# Altium schematic sheet 2_Airframe-Power_2.SchDoc
size A3; SheetNumber: 2; SheetTotal: 2
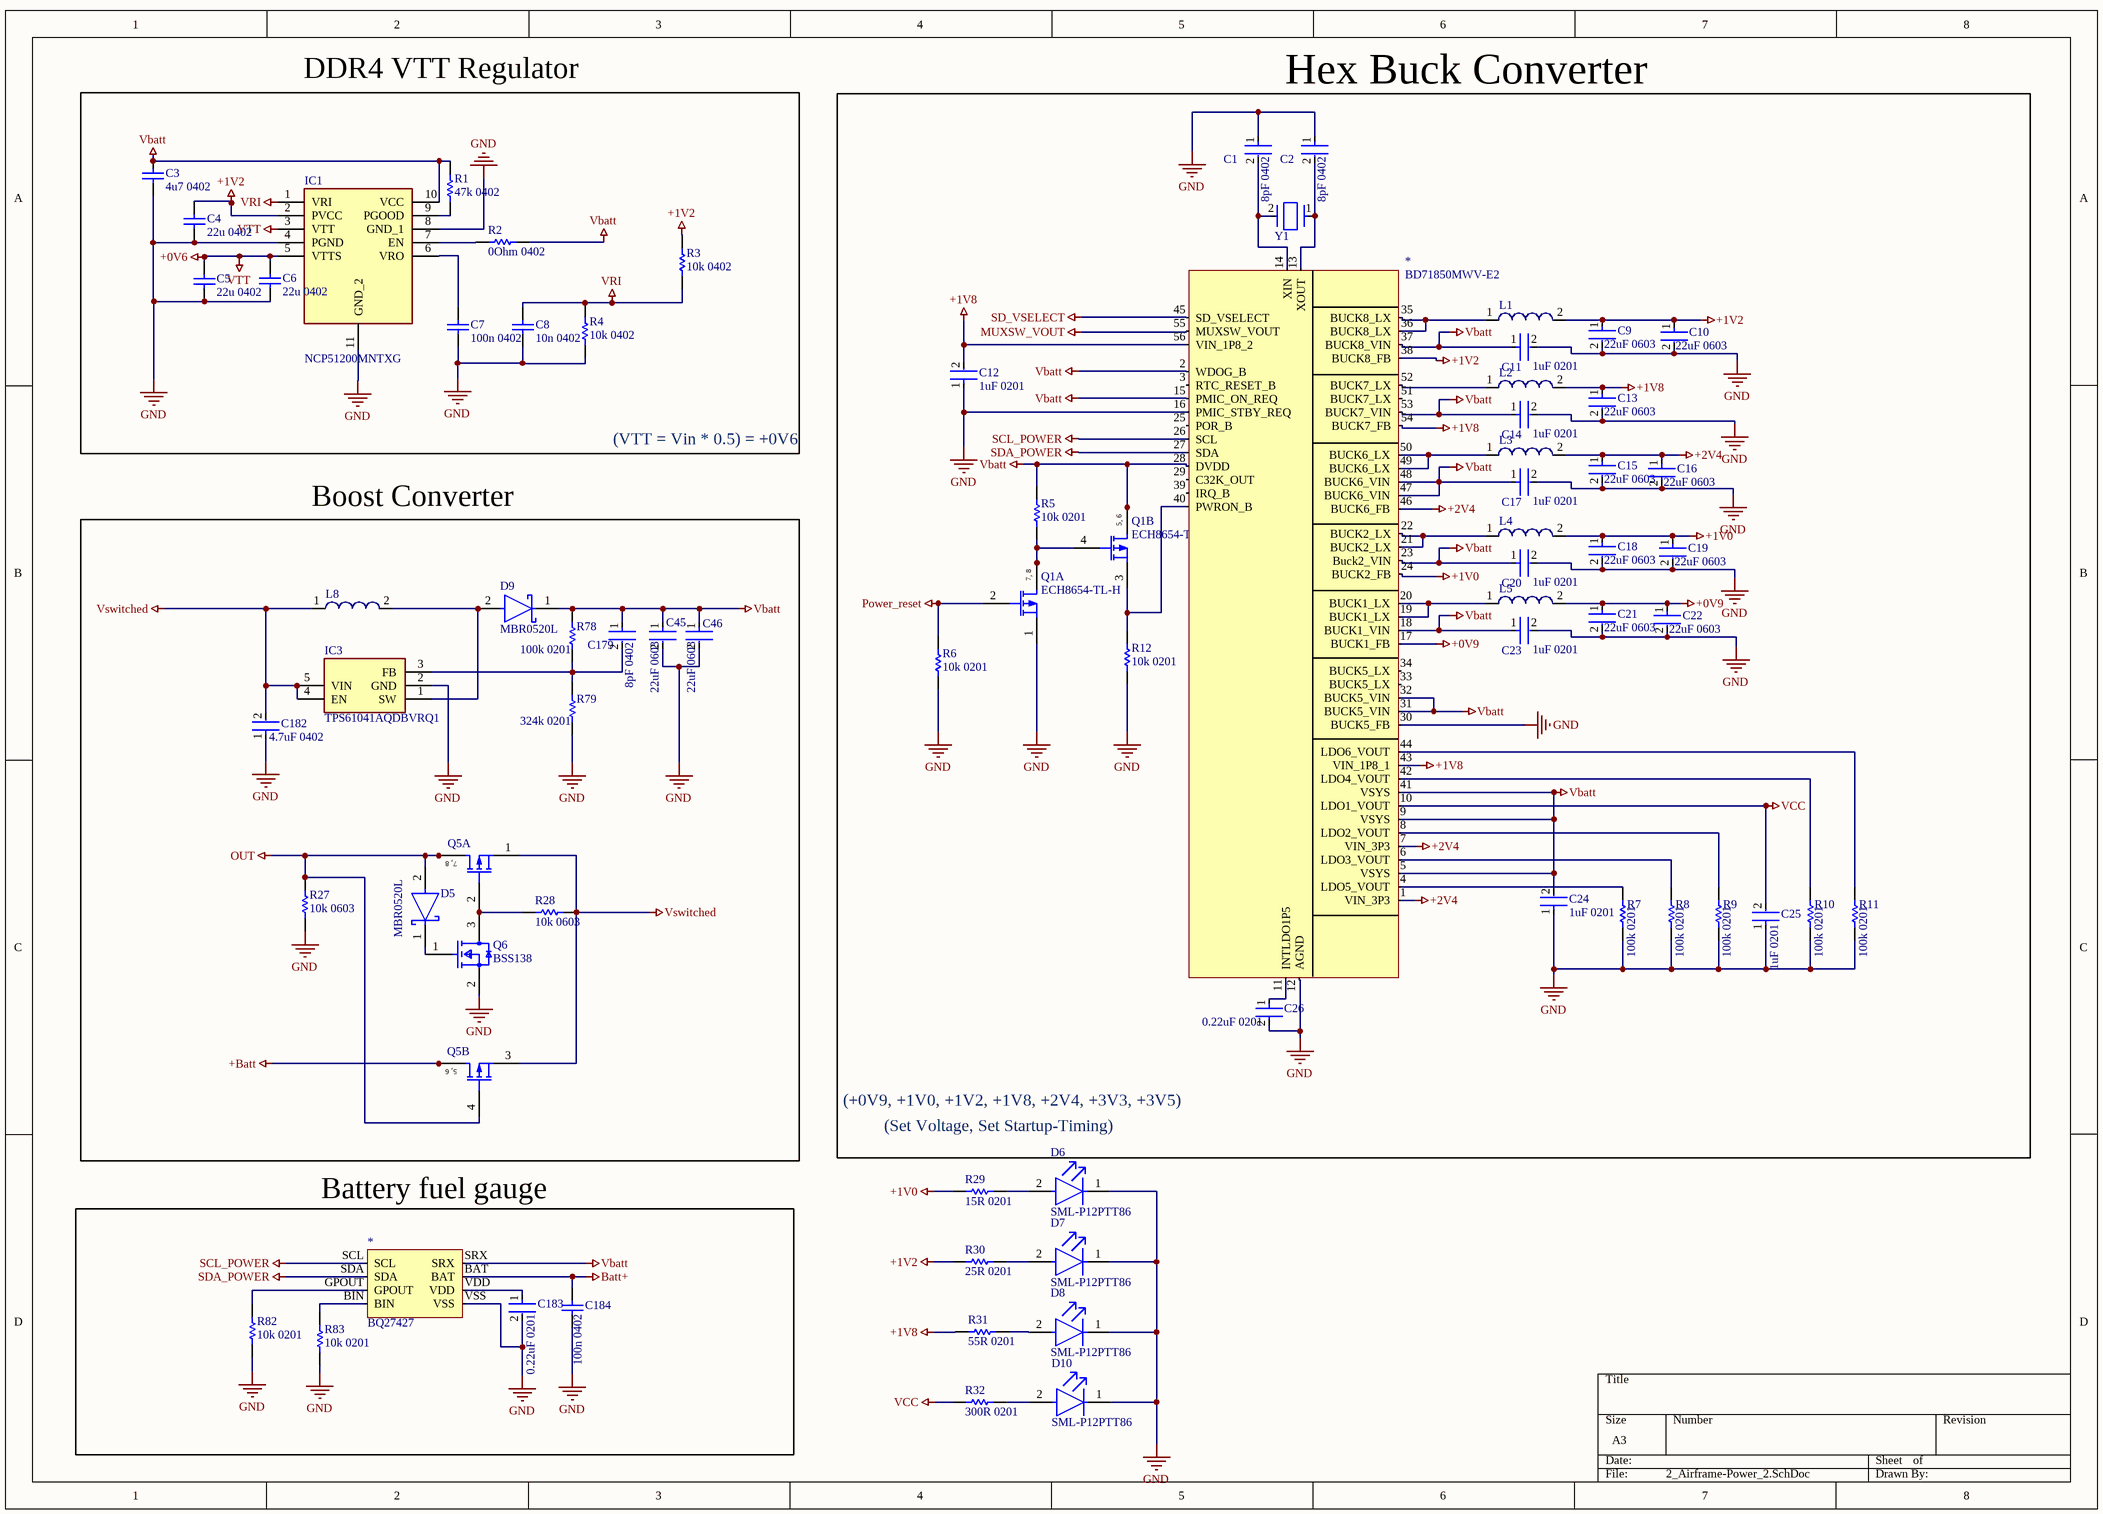
[diagram p0: 2_Airframe-Power_2.SchDoc]

## Parts
(Parts that share a designator on the sheet are numbered #1, #2 ... from top to bottom, then left to right.)
*#1  BD71850MWV-E2  [QFN40P700X700X80_HS-57N]
*#2  BQ27427  [BGA9C50P3X3_158X162X62]
C1  8pF 0402  [FP-C0402C225M9PACTU-MFG]
C2  8pF 0402  [FP-C0402C225M9PACTU-MFG]
C3  4u7 0402  [CAPC1005X55X25ML5T10]
C4  22u 0402  [CAPC1005X55X25ML5T10]
C5  22u 0402  [CAPC1005X55X25ML5T10]
C6  22u 0402  [CAPC1005X55X25ML5T10]
C7  100n 0402  [CAPC1005X55X25ML5T10]
C8  10n 0402  [CAPC1005X55X25ML5T10]
C9  22uF 0603  [FP-GRM188-0_2-IPC_C]
C10  22uF 0603  [FP-GRM188-0_2-IPC_C]
C11  1uF 0201  [FP-C0603-030-0_03-IPC_C]
C12  1uF 0201  [FP-C0603-030-0_03-IPC_C]
C13  22uF 0603  [FP-GRM188-0_2-IPC_C]
C14  1uF 0201  [FP-C0603-030-0_03-IPC_C]
C15  22uF 0603  [FP-GRM188-0_2-IPC_C]
C16  22uF 0603  [FP-GRM188-0_2-IPC_C]
C17  1uF 0201  [FP-C0603-030-0_03-IPC_C]
C18  22uF 0603  [FP-GRM188-0_2-IPC_C]
C19  22uF 0603  [FP-GRM188-0_2-IPC_C]
C20  1uF 0201  [FP-C0603-030-0_03-IPC_C]
C21  22uF 0603  [FP-GRM188-0_2-IPC_C]
C22  22uF 0603  [FP-GRM188-0_2-IPC_C]
C23  1uF 0201  [FP-C0603-030-0_03-IPC_C]
C24  1uF 0201  [FP-C0603-030-0_03-IPC_C]
C25  1uF 0201  [FP-C0603-030-0_03-IPC_C]
C26  0.22uF 0201  [FP-C0603-030-0_03-IPC_C]
C45  22uF 0603  [FP-GRM188-0_2-IPC_C]
C46  22uF 0603  [FP-GRM188-0_2-IPC_C]
C179  8pF 0402  [FP-C0402C225M9PACTU-MFG]
C182  4.7uF 0402  [FP-C0402C225M9PACTU-MFG]
C183  0.22uF 0201  [FP-C0603-030-0_03-IPC_C]
C184  100n 0402  [CAPC1005X55X25ML5T10]
D5  MBR0520L  [FP-MA02A-MFG]
D6  SML-P12PTT86  [FP-SML-P1-MFG]
D7  SML-P12PTT86  [FP-SML-P1-MFG]
D8  SML-P12PTT86  [FP-SML-P1-MFG]
D9  MBR0520L  [FP-MA02A-MFG]
D10  SML-P12PTT86  [FP-SML-P1-MFG]
IC1  NCP51200MNTXG  [SON50P300X300X100-11N]
IC3  TPS61041AQDBVRQ1  [SOT95P280X145-5N]
L1  744040320047  [WE-LQS 3015]  (value not drawn)
L2  744040320047  [WE-LQS 3015]  (value not drawn)
L3  744040320047  [WE-LQS 3015]  (value not drawn)
L4  744040320047  [WE-LQS 3015]  (value not drawn)
L5  744040320047  [WE-LQS 3015]  (value not drawn)
L8  744040320047  [WE-LQS 3015]  (value not drawn)
Q1  ECH8654-TL-H  [ONSC-ECH-8_V]  (parts A,B of 2)
Q5  ECH8654-TL-H  [ONSC-ECH-8_V]  (value not drawn)  (parts A,B of 2)
Q6  BSS138  [FP-318-08-IPC_A]
R1  47k 0402  [RESC1608X55X25ML10T15]
R2  0Ohm 0402  [RESC1608X55X25ML10T15]
R3  10k 0402  [RESC1608X55X25ML10T15]
R4  10k 0402  [RESC1608X55X25ML10T15]
R5  10k 0201  [RESC0603X28X15NL05T05]
R6  10k 0201  [RESC0603X28X15NL05T05]
R7  100k 0201  [RESC0603X28X15NL05T05]
R8  100k 0201  [RESC0603X28X15NL05T05]
R9  100k 0201  [RESC0603X28X15NL05T05]
R10  100k 0201  [RESC0603X28X15NL05T05]
R11  100k 0201  [RESC0603X28X15NL05T05]
R12  10k 0201  [RESC0603X28X15NL05T05]
R27  10k 0603  [RESC1609X55X30LL15T15]
R28  10k 0603  [RESC1609X55X30LL15T15]
R29  15R 0201  [RESC0603X28X15NL05T05]
R30  25R 0201  [RESC0603X28X15NL05T05]
R31  55R 0201  [RESC0603X28X15NL05T05]
R32  300R 0201  [RESC0603X28X15NL05T05]
R78  100k 0201  [RESC0603X28X15NL05T05]
R79  324k 0201  [RESC0603X28X15NL05T05]
R82  10k 0201  [RESC0603X28X15NL05T05]
R83  10k 0201  [RESC0603X28X15NL05T05]
Y1  ABS06-32.768KHZ-9-T  [FP-ABS06-MFG]  (value not drawn)

## Blocks framed on the sheet
(VTT = Vin * 0.5) = +0V6: C3-C8 IC1 R1-R4

## Nets
+0V6: C5.1 C6.1 IC1.3(VTT) IC1.5(VTTS)  [also labelled VTT]
+0V9: *#1.17(BUCK1_FB) C21.1 C22.1 L5.2
+1V0: *#1.24(BUCK2_FB) C18.1 C19.1 L4.2 R29.2
+1V2: *#1.38(BUCK8_FB) C4.1 C9.1 C10.1 IC1.2(PVCC) L1.2 R3.1 R30.2
+1V8: *#1.43(VIN_1P8_1) *#1.54(BUCK7_FB) *#1.56(VIN_1P8_2) C12.2 C13.1 L2.2 R31.2
+2V4: *#1.1(VIN_3P3) *#1.7(VIN_3P3) *#1.46(BUCK6_FB) C15.1 C16.1 L3.2
+Batt: Q5.5(D2) Q5.6(D2)
Batt+: *#2.BAT C184.1
GND: *#1.12(AGND) *#1.16(PMIC_STBY_REQ) *#1.30(BUCK5_FB) *#2.VSS C1.1 C2.1 C3.2 C4.2 C5.2 C6.2 C7.2 C8.2 C9.2 C10.2 C11.2 C12.1 C13.2 C14.2 C15.2 C16.2 C17.2 C18.2 C19.2 C20.2 C21.2 C22.2 C23.2 C24.1 C25.1 C26.2 C45.2 C46.2 C182.1 C183.2 C184.2 D6.1(C) D7.1(C) D8.1(C) D10.1(C) IC1.4(PGND) IC1.8(GND_1) IC1.11(GND_2) IC3.2(GND) Q1.1(S1) Q6.2(S) R4.2 R6.1 R7.1 R8.1 R9.1 R10.1 R11.1 R12.1 R27.1 R79.1 R82.1 R83.1
MUXSW_VOUT: *#1.55(MUXSW_VOUT)
OUT: D5.2(A) Q5.4(G2) Q5.7(D1) Q5.8(D1) R27.2
Power_reset: Q1.2(G1) R6.2
SCL_POWER: *#1.26(SCL) *#2.SCL
SD_VSELECT: *#1.45(SD_VSELECT)
SDA_POWER: *#1.27(SDA) *#2.SDA
Vbatt: *#1.2(WDOG_B) *#1.5(VSYS) *#1.9(VSYS) *#1.15(PMIC_ON_REQ) *#1.18(BUCK1_VIN) *#1.23(Buck2_VIN) *#1.28(DVDD) *#1.31(BUCK5_VIN) *#1.32(BUCK5_VIN) *#1.37(BUCK8_VIN) *#1.41(VSYS) *#1.47(BUCK6_VIN) *#1.48(BUCK6_VIN) *#1.53(BUCK7_VIN) *#2.SRX C3.1 C11.1 C14.1 C17.1 C20.1 C23.1 C24.2 C45.1 C46.1 C179.1 D9.1(C) IC1.10(VCC) Q1.5(D2) Q1.6(D2) R1.2 R2.1 R5.2 R78.2
VCC: *#1.10(LDO1_VOUT) C25.2 R32.2
VRI: C8.1 IC1.1(VRI) R3.2 R4.1
Vswitched: C182.2 IC3.4(EN) IC3.5(VIN) L8.1 Q5.1(S1) Q5.3(S2) R28.2
Net*#1_4: *#1.4(LDO5_VOUT) R7.2
Net*#1_6: *#1.6(LDO3_VOUT) R8.2
Net*#1_8: *#1.8(LDO2_VOUT) R9.2
Net*#1_11: *#1.11(INTLDO1P5) C26.1
Net*#1_13: *#1.13(XOUT) C2.2 Y1.1
Net*#1_14: *#1.14(XIN) C1.2 Y1.2
Net*#1_19: *#1.19(BUCK1_LX) *#1.20(BUCK1_LX) L5.1
Net*#1_21: *#1.21(BUCK2_LX) *#1.22(BUCK2_LX) L4.1
Net*#1_35: *#1.35(BUCK8_LX) *#1.36(BUCK8_LX) L1.1
Net*#1_40: *#1.40(PWRON_B) Q1.3(S2) R12.2
Net*#1_42: *#1.42(LDO4_VOUT) R10.2
Net*#1_44: *#1.44(LDO6_VOUT) R11.2
Net*#1_49: *#1.49(BUCK6_LX) *#1.50(BUCK6_LX) L3.1
Net*#1_52: *#1.52(BUCK7_LX) L2.1
Net*#2_BIN: *#2.BIN R83.2
Net*#2_GPOUT: *#2.GPOUT R82.2
Net*#2_VDD: *#2.VDD C183.1
NetC7_1: C7.1 IC1.6(VRO)
NetC179_2: C179.2 IC3.3(FB) R78.1 R79.2
NetD5_1: D5.1(C) Q6.1(G)
NetD6_2: D6.2(A) R29.1
NetD7_2: D7.2(A) R30.1
NetD8_2: D8.2(A) R31.1
NetD9_2: D9.2(A) IC3.1(SW) L8.2
NetD10_2: D10.2(A) R32.1
NetIC1_7: IC1.7(EN) R2.2
NetIC1_9: IC1.9(PGOOD) R1.1
NetQ1_4: Q1.4(G2) Q1.7(D1) Q1.8(D1) R5.1
NetQ5_2: Q5.2(G1) Q6.3(D) R28.1

Not connected (* = marked no-connect by the designer): *#1 3(RTC_RESET_B) 25(POR_B) 29(C32K_OUT) 33(BUCK5_LX) 34(BUCK5_LX) 39(IRQ_B) 51(BUCK7_LX)

## Notes on the sheet
- DDR4 VTT Regulator
- Hex Buck Converter
- Boost Converter
- (Set Voltage, Set Startup-Timing)
- (+0V9, +1V0, +1V2, +1V8, +2V4, +3V3, +3V5)
- Battery fuel gauge
- (in symbol CMP-1058-00438-1, part A) 7, 8
- (in symbol CMP-1058-00438-1, part B) 5, 6

## Library data of the parts
*#1 = CMP-00001-3: Step Down DC-DC Converter with LDO Regulator 12-OUT 56-Pin UQFN Emboss T/R PMIC i.MX 8M Nano UQFN56BV7070; Voltage - Output 1: 1.3V; Voltage - Output 3: 1.35V; Switching Frequency: 2MHz; Number of Outputs: 12; Min Operating Temperature: -40°C; Series: -; Max Operating Temperature: 85°C; RoHS Compliant: Yes; ComponentLink1Description: Link:; Mount: Surface Mount; ComponentLink1URL: https://eu.mouser.com/ProductDetail/ROHM-Semiconductor/BD71850MWV-E2?qs=Cb2nCFKsA8q%2FlLq8hwnX9w%3D%3D; Voltage - Output 2: 1.3V
*#2 = CMP-00004-1
C1 C2 C179 C182 = CMP-2008-02064-3: CAP CER 2.2UF 6.3V X5R 0402; Tolerance: 20%; Dissipation Factor: 5%; Dielectric Material: Ceramic; Lead Free: Lead Free; Depth: 0.5mm; Series: C; Termination: SMD/SMT; Case Code (Metric): 1005; Case/Package: 0402; Dielectric: X5R; RoHS Compliant: Yes; Thickness: 0.022inch; Voltage Rating: 6.3V; Voltage: 6.3V; Height: 0.5mm; Mount: Surface Mount; Construction: Flat; Case Code (Imperial): 0402; Min Operating Temperature: -55°C; Contact Plating: Tin; Radiation Hardening: No; Number of Pins: 2; Voltage Rating (DC): 6.3V; Capacitance: 2.2uF; Width: 0.5mm; Package Quantity: 1; Packaging: Tape and Reel; Max Operating Temperature: 85°C; Length: 1mm; REACH SVHC: No SVHC
C3-C8 C184 = CMP-1662-00017-1: Chip Capacitor, 1 nF, +/- 10%, 50 V, -55 to 125 degC, 0402 (1005 Metric), RoHS, Tape and Reel; Case\/Package: 0402; Type (Capacitors): X7R; Voltage Rating (DC): 50 V; Capacitance: 1 nF; Width: 0.5 mm; Pins: 2; REACH SVHC: No SVHC; Length: 1 mm; Height: 0.5 mm; PackageDescription: 2-Pin Surface Mount Device, Body 1 x 0.5 mm; DatasheetVersion: 07/2016; Mount: Surface Mount; ComponentLink2Description: Datasheet; Tolerance: 10%; ComponentLink2URL: http://psearch.en.murata.com/capacitor/product/GRM155R71H102KA01%23.pdf; ComponentLink1URL: http://www.murata.com/; Case Code (Metric): 1005; Package Quantity: 10000; Min Operating Temperature: -55 degC; Max Operating Temperature: 125 degC; Voltage Rating: 50 V; ComponentLink1Description: Manufacturer URL; Packaging: Tape and Reel; Radiation Hardening: No; RoHSCompliant: true; PackageReference: 0402; Mounting Technology: Surface Mount; Case Code (Imperial): 0402
C9 C10 C13 C15 C16 C18 C19 C21 C22 C45 C46 = CMP-2000-06337-3: Chip Multilayer Ceramic Capacitors for General Purpose, 0603, 22uF, X5R, 15%, 20%, 10V; Tolerance: 20%; Weight: 0.000222oz; Material: Ceramic; Depth: 0.8mm; Length: 1.6mm; Termination: SMD/SMT; Capacitance: 22uF; Packaging: Tape and Reel; Width: 0.8mm; Voltage Rating: 10V; Case Code (Imperial): 0603; Mount: Surface Mount; Voltage Rating (DC): 10V; Case/Package: 0603; Thickness: 0.039inch; REACH SVHC: No SVHC; Dielectric: X5R; Height: 0.8mm; Package Quantity: 4000; Case Code (Metric): 1608; Min Operating Temperature: -55°C; Lead Free: Lead Free; Max Operating Temperature: 85°C
C11 C12 C14 C17 C20 C23-C26 C183 = CMP-08246-007095-1: Multilayer Ceramic Capacitors 220nF ±10% 6.3V X6S SMD 0201; Dielectric: X6S; Resistor Type: Ceramic; Length: 0.6mm; Capacitance: 220nF; Case Code (Metric): 0603; Series: C; Width: 0.012inch; Height: 0.3mm; Voltage Rating: 6.3V; Max Operating Temperature: 105°C; REACH SVHC: No SVHC; RoHS Compliant: Yes; Tolerance: 10%; Termination: SMD/SMT; Case/Package: 0201; Case Code (Imperial): 0201; Weight: 6E-06oz; Lead Free: Lead Free; Construction: Flat; Thickness: 300um; Mount: Surface Mount; Dielectric Material: Ceramic; Voltage Rating (DC): 6.3V; Packaging: Cut Tape; Package Quantity: 1; Min Operating Temperature: -55°C; Depth: 0.3mm
D5 D9 = CMP-2000-04926-2: DIODE SCHOTTKY 20V 500MA SOD123; Current Rating: 500A; Peak Non-Repetitive Surge Current: 5.5A; Peak Reverse Current: 250uA; Power Dissipation: 400mW; Polarity: Standard; Element Configuration: Single; Capacitance: 4pF; Forward Voltage: 385mV; Voltage Rating (DC): 20V; Max Reverse Voltage (DC): 20V; Packaging: Tape and Reel; Min Operating Temperature: -65°C; Max Repetitive Reverse Voltage (Vrrm): 20V; Forward Current: 500mA; Max Operating Temperature: 125°C; Width: 1.6mm; Height: 1.03mm; Max Forward Surge Current (Ifsm): 5.5A; Mount: Surface Mount; Max Reverse Leakage Current: 250uA; Weight: 0.03g; Package Quantity: 3000; Max Surge Current: 5.5A; Radiation Hardening: No; REACH SVHC: No SVHC; Average Rectified Current: 500mA; Output Current: 500mA; Length: 2.7mm; Number of Pins: 2; Lead Free: Lead Free
D6-D8 D10 = CMP-08952-000020-1: LED GREEN CLEAR 1006 SMD; Manufacturer: Rohm; Led Orientation: Top View; Wavelength: 560nm; Forward Current: 20mA; Reverse Voltage: 5V; Power Dissipation: 52mW; Forward Voltage: 2.1V; Luminous Intensity: 10mcd; Device Class L1: Optoelectronics; Digikey Description: LED GREEN CLEAR 1006 SMD; Lead Free: Yes; Manufacturer Part Number: SML-P12PTT86; Temperature Range High: +85°C; Octopart: https://octopart.com/sml-p12ptt86-rohm-9290705; Device Class L2: LEDs; Colour: Green; RoHS: TRUE; Height: 0.25mm; Automotive: No; Device Class L3: unset; Temperature Range Low: -40°C; ComponentLink2Description: Datasheet; Mouser Description: Standard LEDs - SMD SMD Green 13 mcd height=0.2; Category: Diode; ComponentLink2URL: https://www.rohm.com/datasheet/SML-P12DT(R); Temperature: -40°C to +85°C; Package: SML-P1
IC1 = NCP51200MNTXG: Integrated Circuit; Manufacturer_Name: onsemi; Datasheet Link: http://www.onsemi.com/pub/Collateral/NCP51200-D.PDF; Height: 1mm; Manufacturer_Part_Number: NCP51200MNTXG; Mouser Part Number: 863-NCP51200MNTXG; Mouser Price/Stock: https://www.mouser.co.uk/ProductDetail/onsemi/NCP51200MNTXG?qs=mt7EBqA2jzgnxcGILBvARw%3D%3D; Arrow Part Number: NCP51200MNTXG; Arrow Price/Stock: https://www.arrow.com/en/products/ncp51200mntxg/on-semiconductor?region=europe
IC3 = TPS61041AQDBVRQ1: Integrated Circuit; Manufacturer_Name: Texas Instruments; Datasheet Link: https://www.ti.com/lit/ds/symlink/tps61040-q1.pdf?HQS=dis-mous-null-mousermode-dsf-pf-null-wwe&ts=1670579474018&ref_url=https%253A%252F%252Fwww.mouser.pl%252F; Height: 1.45mm; Manufacturer_Part_Number: TPS61041AQDBVRQ1; Mouser Part Number: 595-TPS61041AQDBVRQ1; Mouser Price/Stock: https://www.mouser.co.uk/ProductDetail/Texas-Instruments/TPS61041AQDBVRQ1?qs=vvQtp7zwQdNkluciYEavBw%3D%3D
L1-L5 L8 = CMP-1354-00019-1: WE-LQS SMD Power Inductor, L=0.47; Manufacturer: Wuerth Elektronik; Inductance: 0.47 ÂµH; PartNumber: 744040320047; ComponentLink2URL: http://katalog.we-online.de/pbs/datasheet/744040320047.pdf; ComponentLink1URL: http://www.we-online.com; ComponentLink1Description: Manufacturer URL; ComponentLink2Description: Datasheet; PackageReference: WE-LQS 3015
Q1 Q5 = CMP-1058-00438-1: P-Channel Power MOSFET, -20 V, -5 A, 38 mOhm, Dual, 8-Pin ECH, Pb-Free, Tape and Reel; Manufacturer: On Semiconductor; VGS(th) Max (V): 1.3; Ciss Typ (pF): 960; ID Max (A): 5; Channel Polarity: P Channel; Crss Typ (pF): 140; VGS Max (V): 10; Coss Typ (pF): 180; V(BR)DSS Min (V): 20; Configuration: Dual; ComponentLink1Description: Manufacturer URL; ComponentLink3Description: Package Specification; PackageDescription: 8-Pin SOT23, Body 2.9 x 2.3 mm, Pitch 0.65 mm; ComponentLink2Description: Datasheet; RoHS: Pb-Free; PD Max (W): 1.3; ComponentLink2URL: http://www.onsemi.com/pub_link/Collateral/ENA0981-D.PDF; PartNumber: ECH8654-TL-H; PackageReference: ECH-8; ComponentLink1URL: http://www.onsemi.com/; ComponentLink3URL: http://www.onsemi.com/pub_link/Collateral/ECH8308-D.PDF; Package Type: SOT-28 FL / ECH-8; Packing: Tape and Reel; Mounting Technology: Surface Mount
Q6 = CMP-07173-000101-1: MOSFET N-CH 50V 220MA SOT-23; Turn-Off Delay Time: 20ns; Element Configuration: Single; Rds On Max: 3.5R; Gate to Source Voltage (Vgs): 20V; Threshold Voltage: 1.3V; Number of Elements: 1; Power Dissipation: 360mW; Rise Time: 9ns; Turn-On Delay Time: 2.5ns; Input Capacitance: 27pF; On-State Resistance: 6R; Lead Free: Lead Free; Length: 2.92mm; Width: 1.3mm; Drain to Source Breakdown Voltage: 50V; Min Operating Temperature: -55°C; REACH SVHC: No SVHC; Packaging: Tape and Reel; Radiation Hardening: No; Height: 0.93mm; Drain to Source Voltage (Vdss): 50V; Current Rating: 220mA; Voltage Rating (DC): 50V; Weight: 0.03g; Continuous Drain Current (ID): 220mA; Number of Pins: 3; Nominal Vgs: 1.3V; Max Power Dissipation: 360mW; Fall Time: 9ns; Drain to Source Resistance: 3.5R; Contact Plating: Tin; Case/Package: SOT-23; Package Quantity: 1; Dual Supply Voltage: 50V; Mount: Surface Mount; Termination: SMD/SMT; Max Operating Temperature: 150°C
R1 R3 R4 = CMP-2100-03667-1: Manufacturer: Yageo; Temperature Coefficient: 200ppm/degreesC; Tolerance: 5%; Voltage Rating: 50V; Power Rating: 100mW; Resistance: 0mOhm; Width: 0.8mm; Max Operating Temperature: 155degC; Package Reference: 0603; Height: 0.45mm; Depth: 0.8mm; Package Description: 2-Pin Surface Mount Device, Body 1.6 x 0.8 mm; Termination: SMD/SMT; Package Quantity: 5000; Case/Package: 0603; Case Code (Imperial): 0603; Radiation Hardening: No; Number of Pins: 2; Length: 1.6mm; Lead Free: LeadFree; Voltage Rating (DC): 50V; Military Standard: Not; Datasheet URL: http://www.yageo.com/NewPortal/yageodocoutput?fileName=/pdf/R-Chip/PYu-RC_Group_51_RoHS_L_5.pdf; Manufacturer URL: http://www.yageo.com/; Packaging: TapeandReel; Case Code (Metric): 1608; Min Operating Temperature: -55degC; Composition: ThickFilm; RoHSCompliant: true; Contact Plating: Tin; Datasheet Version: Rev. 5, 10/2016; REACH SVHC: NoSVHC
R2 = CMP-2100-03667-1: Chip Resistor, 0 Ohm, +/- 5%, 0.1 W, -55 to 155 degC, 0603 (1608 Metric), RoHS, Tape and Reel; Manufacturer: Yageo; Temperature Coefficient: 200ppm/degreesC; Voltage Rating: 50V; Power Rating: 100mW; Resistance: 0mOhm; Width: 0.8mm; Max Operating Temperature: 155degC; Tolerance: 5%; Package Reference: 0603; Height: 0.45mm; Depth: 0.8mm; Package Description: 2-Pin Surface Mount Device, Body 1.6 x 0.8 mm; Termination: SMD/SMT; Package Quantity: 5000; Case/Package: 0603; Case Code (Imperial): 0603; Radiation Hardening: No; Number of Pins: 2; Length: 1.6mm; Lead Free: LeadFree; Voltage Rating (DC): 50V; Military Standard: Not; Datasheet URL: http://www.yageo.com/NewPortal/yageodocoutput?fileName=/pdf/R-Chip/PYu-RC_Group_51_RoHS_L_5.pdf; Manufacturer URL: http://www.yageo.com/; Packaging: TapeandReel; Case Code (Metric): 1608; Min Operating Temperature: -55degC; Composition: ThickFilm; RoHSCompliant: true; Contact Plating: Tin; Datasheet Version: Rev. 5, 10/2016; REACH SVHC: NoSVHC
R5 R6 R12 R78 R79 R82 R83 = CMP-2004-00016-1: Manufacturer: Vishay Dale; Part Number: CRCW020110K0FNED
R7-R11 R29-R32 = CMP-2004-00006-1: Manufacturer: Vishay; Part Number: CRCW0201100RFNED
R27 R28 = CMP-1012-00623-3: Chip Resistor, 10 KOhm, +/- 1%, 0.1 W, -55 to 155 degC, 0603 (1608 Metric), RoHS, Tape and Reel; Manufacturer: Panasonic; Voltage Rating: 75V; Case\/Package: 0603; Power Rating: 100mW; Resistance: 10KOhm; Temperature Coefficient: 100ppm\/degreesC; Number of Pins: 2; Package Reference: 603; Depth: 0.8mm; Mount: SurfaceMount; Package Description: 2-Pin Surface Mount Device, Body 1.6 x 0.85 mm; Datasheet Version: 02/2017; Length: 1.6mm; Lead Free: LeadFree; Height: 0.45mm; Number of Terminations: 2; Max Power Dissipation: 100mW; Min Operating Temperature: -55degC; Datasheet URL: https://industrial.panasonic.com/cdbs/www-data/pdf/RDA0000/AOA0000C304.pdf; Termination: SMD/SMT; Case Code (Metric): 1608; Case Code (Imperial): 0603; Tolerance: 1%; Max Operating Temperature: 155degC; RoHSCompliant: true; Voltage Rating (DC): 75V; Radiation Hardening: No; Packaging: TapeandReel; Composition: ThickFilm; Mounting Technology: SurfaceMount; Manufacturer URL: http://www.panasonic.com/; Width: 0.031inch; REACH SVHC: NoSVHC; Contact Plating: Tin; Military Standard: Not; Package Quantity: 1
Y1 = CMP-27762-015421-1: Crystal 32.768kHz ±20ppm (Tol) 9pF FUND 90kΩ 2-Pin Mini-CSMD T/R; ESR (Equivalent Series Resistance): 90kR; Max Operating Temperature: 85°C; Frequency Tolerance: 20ppm; Case/Package: CSMD; Termination: SMD/SMT; RoHS Compliant: Yes; Height: 0.6mm; Load Capacitance: 9pF; Packaging: Tape and Reel; Depth: 1.2mm; Tolerance: 20ppm; Frequency: 32.768kHz; Series: ABS06; Width: 1.2mm; Length: 2mm; Number of Pins: 2; Min Operating Temperature: -40°C; Mount: Surface Mount; Lead Free: Lead Free; Package Quantity: 3000